# EAGLE design Rain Collector Outside v2 (EAGLE 6.5.0)
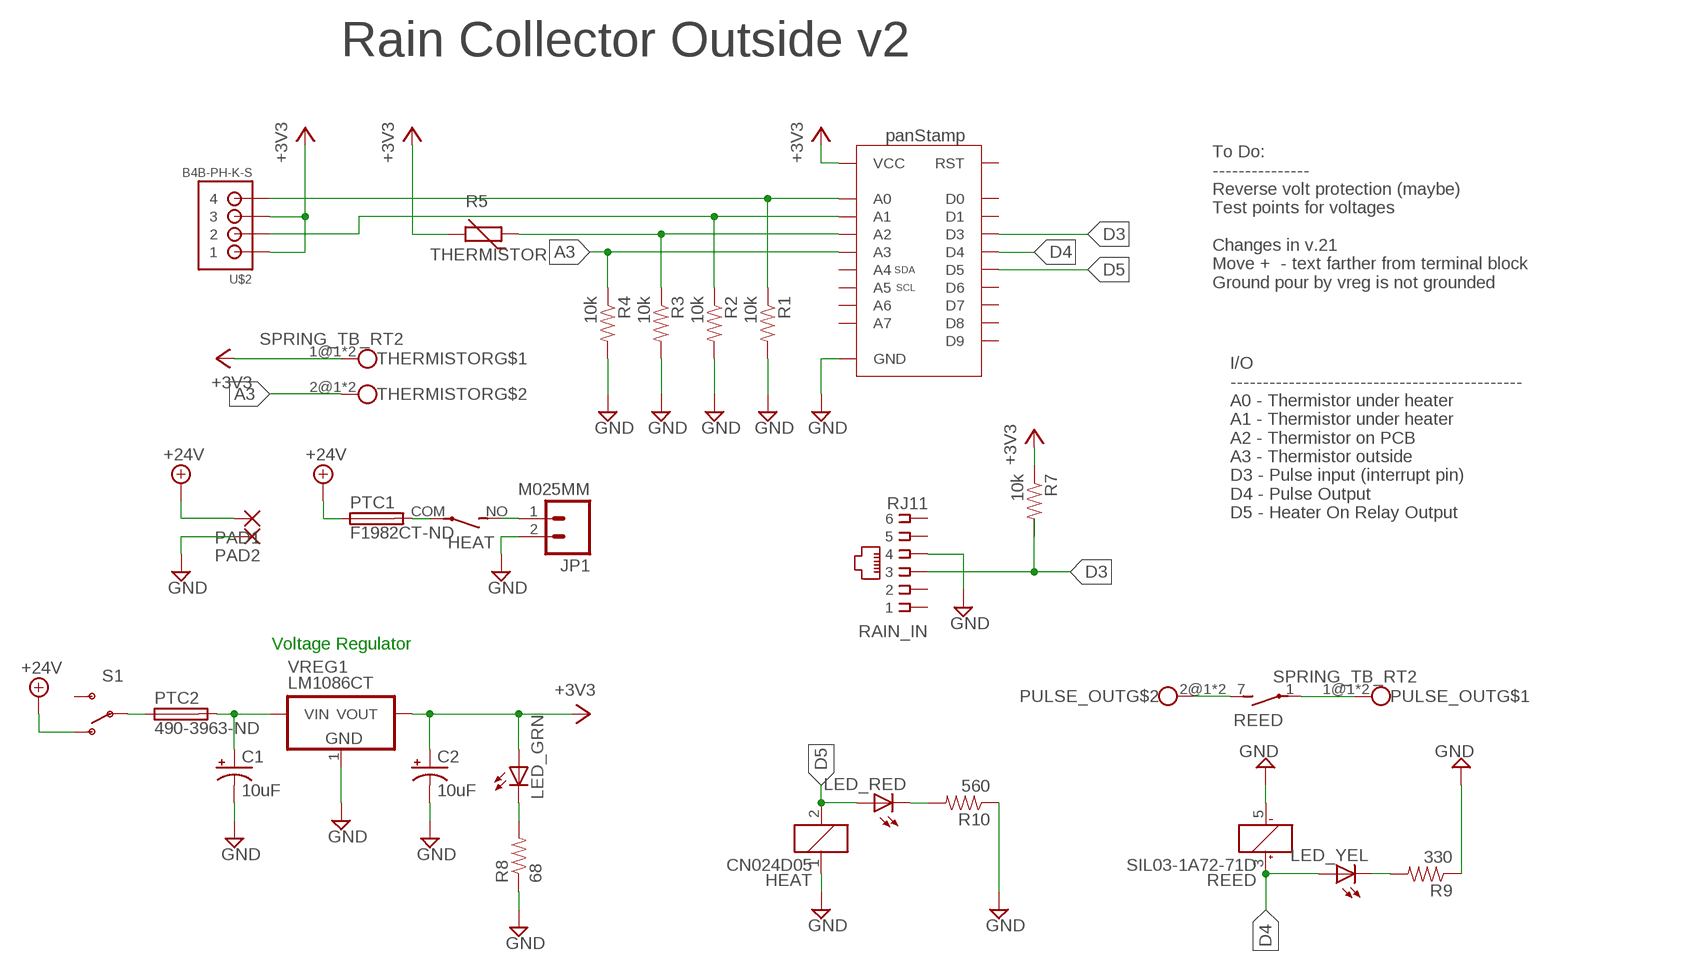
[diagram p0: schematic, sheet 1]

## Parts
C1  10uF  CAP_POLPTH2  [CPOL-RADIAL-10UF-25V]
C2  10uF  CAP_POLPTH2  [CPOL-RADIAL-10UF-25V]
HEAT  CN024D05  APF30212A  [APF30212A]
JP1  M025MM  [SCREWTERMINAL-5MM-2]
LED_GRN  LED3MM  [LED3MM]
LED_RED  LED3MM  [LED3MM]
LED_YEL  LED3MM  [LED3MM]
PAD1  3,17/1,3  [3,17/1,3]
PAD2  3,17/1,3  [3,17/1,3]
PANSTAMP  PANSTAMPNO_TEXT  [PANSTAMP_NOTEXT]
PTC1  F1982CT-ND  TE5  [TE5]
PTC2  490-3963-ND  TE5  [TE5]
PULSE_OUT  SPRING_TB_RT2  [SPRING_TB_RT2]
R1  10k  RESISTORAXIAL-0.3  [AXIAL-0.3]
R2  10k  RESISTORAXIAL-0.3  [AXIAL-0.3]
R3  10k  RESISTORAXIAL-0.3  [AXIAL-0.3]
R4  10k  RESISTORAXIAL-0.3  [AXIAL-0.3]
R5  THERMISTOR  THERMISTOR-2,5  [RS-2,5]
R7  10k  RESISTORAXIAL-0.3  [AXIAL-0.3]
R8  68  RESISTORAXIAL-0.3  [AXIAL-0.3]
R9  330  RESISTORAXIAL-0.3  [AXIAL-0.3]
R10  560  RESISTORAXIAL-0.3  [AXIAL-0.3]
RAIN_IN  RJ11  RJ11-2X  [RJ11-NO_SHIELD]
REED  SIL03-1A72-71D  REED  [REED]
S1  SWITCH-SPDTPTH  [SWITCH-SPDT]
THERMISTOR  SPRING_TB_RT2  [SPRING_TB_RT2]
U$2  B4B-PH-K-S  JST-PH_4-PIN_HEADER  [JST_B4B-PH_HEADER]
VREG1  LM1086CT  VREG_3PINS-TO-220V  [TO-220V]

## Nets
+3V3 [Power]: C2.1(+) LED_GRN.A PANSTAMP.VCC R5.2 R7.P$1 THERMISTOR.1@1 THERMISTOR.1@2 U$2.P1 U$2.P3 VREG1.2(VOUT)
+24V [Heater]: PAD1.1(P) PTC1.1 S1.1(O)
A0: PANSTAMP.A0 R1.P$1 U$2.P4
A1: PANSTAMP.A1 R2.P$1 U$2.P2
A2: PANSTAMP.A2 R3.P$1 R5.1
A3: PANSTAMP.A3 R4.P$1 THERMISTOR.2@1 THERMISTOR.2@2
D3: PANSTAMP.D3 R7.P$2 RAIN_IN.3
D4: LED_YEL.A PANSTAMP.D4 REED.3(1:+)
D5: HEAT.2 LED_RED.A PANSTAMP.D5
GND: C1.2(-) C2.2(-) HEAT.1 JP1.2 PAD2.1(P) PANSTAMP.GND$1(GND) PANSTAMP.GND$7(GND) PANSTAMP.GND$15(GND) PANSTAMP.GND$23(GND) PANSTAMP.GND$24(GND) R1.P$2 R2.P$2 R3.P$2 R4.P$2 R8.P$1 R9.P$1 R10.P$1 RAIN_IN.4 REED.5(1:-) VREG1.1(GND)
N$1: PULSE_OUT.2@1 PULSE_OUT.2@2 REED.7(2:S)
N$2: PULSE_OUT.1@1 PULSE_OUT.1@2 REED.1(2:P)
N$3 [Heater]: HEAT.NO(2:S) JP1.1
N$4: LED_GRN.K(C) R8.P$2
N$5: LED_YEL.K(C) R9.P$2
N$6: LED_RED.K(C) R10.P$2
N$7: PTC2.1 S1.2(P)
N$8 [Heater]: C1.1(+) PTC2.2 VREG1.3(VIN)
N$10: HEAT.COM(2:P) PTC1.2
Unconnected: PANSTAMP.A4 PANSTAMP.A5 PANSTAMP.A6 PANSTAMP.A7 PANSTAMP.D0 PANSTAMP.D1 PANSTAMP.D6 PANSTAMP.D7 PANSTAMP.D8 PANSTAMP.D9 PANSTAMP.RESET(RST) RAIN_IN.1 RAIN_IN.2 RAIN_IN.5 RAIN_IN.6 S1.3(S)

## Notes on the sheet
- Rain Collector Outside v2
- To Do:
  ---------------
  Reverse volt protection (maybe)
  Test points for voltages
  
  Changes in v.21
  Move +  - text farther from terminal block
  Ground pour by vreg is not grounded
- I/O
  ---------------------------------------------
  A0 - Thermistor under heater
  A1 - Thermistor under heater
  A2 - Thermistor on PCB
  A3 - Thermistor outside
  D3 - Pulse input (interrupt pin)
  D4 - Pulse Output
  D5 - Heater On Relay Output
- Voltage Regulator

## Library data of the parts
C1 C2 = SparkFun-Capacitors:CAP_POL: Capacitor Polarized These are standard SMD and PTH capacitors. Normally 10uF, 47uF, and 100uF in electrolytic and tantalum varieties. Always verify the external diameter of the through hole cap, it varies with capacity, voltage, and manufacturer. The EIA devices should be standard.; PARTNO: 478-6062-ND
HEAT = relay:APF30212A: Compliant with European standards 1a/1c 6A Slim power relays Source: Data sheet <http://pewa.panasonic.com/assets/pcsd/catalog/pf-catalog.pdf>; OC_FARNELL: unknown; PARTNO: CC1742-ND
JP1 = SparkFun-Connectors:M02: Standard 2-pin 0.1" header. Use with - straight break away headers ( PRT-00116) - right angle break away headers (PRT-00553) - swiss pins (PRT-00743) - machine pins (PRT-00117) - female headers (PRT-00115) Molex polarized connector foot print use with: PRT-08233 with associated crimp pins and housings. 2.54_SCREWTERM for use with PRT-10571. 3.5mm Screw Terminal footprints for PRT-08084 5mm Screw Terminal footprints for use with PRT-08433; PARTNO: Sparkfun PRT-08432
LED_GRN LED_RED LED_YEL = led:LED: LED OSRAM: - CHIPLED LG R971, LG N971, LY N971, LG Q971, LY Q971, LO R971, LY R971 LH N974, LH R974 LS Q976, LO Q976, LY Q976 LO Q996 - Hyper CHIPLED LW Q18S LB Q993, LB Q99A, LB R99A - SideLED LS A670, LO A670, LY A670, LG A670, LP A670 LB A673, LV A673, LT A673, LW A673 LH A674 LY A675 LS A676, LA A676, LO A676, LY A676, LW A676 LS A679, LY A679, LG A679 - Hyper Micro SIDELED® LS Y876, LA Y876, LO Y876, LY Y876 LT Y87S - SmartLED LW L88C, LW L88S LB L89C, LB L89S, LG L890 LS L89K, LO L89K, LY L89K LS L896, LA L896, LO L896, LY L896 - TOPLED LS T670, LO T670, LY T670, LG T670, LP T670 LSG T670, LSP T670, LSY T670, LOP T670, LYG T670 LG T671, LOG T671, LSG T671 LB T673, LV T673, LT T673, LW T673 LH T674 LS T676, LA T676, LO T676, LY T676, LB T676, LH T676, LSB T676, LW T676 LB T67C, LV T67C, LT T67C, LS T67K, LO T67K, LY T67K, LW E67C LS E67B, LA E67B, LO E67B, LY E67B, LB E67C, LV E67C, LT E67C LW T67C LS T679, LY T679, LG T679 LS T770, LO T770, LY T770, LG T770, LP T770 LB T773, LV T773, LT T773, LW T773 LH T774 LS E675, LA E675, LY E675, LS T675 LS T776, LA T776, LO T776, LY T776, LB T776 LHGB T686 LT T68C, LB T68C - Hyper Mini TOPLED® LB M676 - Mini TOPLED Santana® LG M470 LS M47K, LO M47K, LY M47K Source: http://www.osram.convergy.de LUXEON: - LUMILED® LXK2-PW12-R00, LXK2-PW12-S00, LXK2-PW14-U00, LXK2-PW14-V00 LXK2-PM12-R00, LXK2-PM12-S00, LXK2-PM14-U00 LXK2-PE12-Q00, LXK2-PE12-R00, LXK2-PE12-S00, LXK2-PE14-T00, LXK2-PE14-U00 LXK2-PB12-K00, LXK2-PB12-L00, LXK2-PB12-M00, LXK2-PB14-N00, LXK2-PB14-P00, LXK2-PB14-Q00 LXK2-PR12-L00, LXK2-PR12-M00, LXK2-PR14-Q00, LXK2-PR14-R00 LXK2-PD12-Q00, LXK2-PD12-R00, LXK2-PD12-S00 LXK2-PH12-R00, LXK2-PH12-S00 LXK2-PL12-P00, LXK2-PL12-Q00, LXK2-PL12-R00 Source: www.luxeon.com KINGBRIGHT: KA-3528ASYC Source: www.kingbright.com
PAD1 PAD2 = wirepad:3,17/1,3: THROUGH-HOLE PAD
PANSTAMP = SRG:PANSTAMP: panStamp panStamps are small wireless modules programmable from the Arduino IDE. Each module contains an Atmega328p MCU and a Texas Instruments CC1101 RF interface, providing the necessary connectivity and processing power to create autonomous low-power wireless motes. Everything contained into a compact DIP-24 module. http://www.panstamp.com Vin: 2.5 to 3.6 volts A4 - SDA A5 - SCL PWM: D3,5,6,9,10,11 Interrupts: D2,3 Connected grounds with command: CONNECT ANY GND 'GND$1 GND$7 GND$15 GND$23 GND$24';
PTC1 = fuse:TE5: FUSE Wickmann; OC_FARNELL: unknown; OC_NEWARK: unknown; PARTNO: F1982CT-ND
PTC2 = fuse:TE5: FUSE Wickmann; OC_FARNELL: unknown; OC_NEWARK: unknown; PARTNO: 490-3963-ND
PULSE_OUT = SRG:SPRING_TB_RT2: Spring Loaded Terminal Block 4UCON 0.10 pitch right angle 2 amps 20-26 AWG Adafruit: P/N 1074 <http://www.adafruit.com/products/1074> Terminal block comes with 3 terminals, but the are modular so you can add or remove terminals; PARTNO: Sprakfun PRT-08073
R1-R4 R7 = SparkFun-Resistors:RESISTOR: Resistor Basic schematic elements and footprints for 0603, 1206, and PTH resistors.; PARTNO: RNF18FTD10K0CT-ND
R5 = varistor:THERMISTOR: THERMISTOR; PARTNO: BC2301-ND
R8 = SparkFun-Resistors:RESISTOR: Resistor Basic schematic elements and footprints for 0603, 1206, and PTH resistors.; PARTNO: CF18JT68R0CT-ND
R9 = SparkFun-Resistors:RESISTOR: Resistor Basic schematic elements and footprints for 0603, 1206, and PTH resistors.; PARTNO: CF18JT330RCT-ND
R10 = SparkFun-Resistors:RESISTOR: Resistor Basic schematic elements and footprints for 0603, 1206, and PTH resistors.; PARTNO: CF18JT560RCT-ND
RAIN_IN = con-tycoelectronics:RJ11: CORCOM Modular RJ Jacks No Shield Source: www.tycoelectronics.com .. ENG_DS_1654001_1099_RJ_L_0507.pdf; OC_FARNELL: unknown; OC_NEWARK: unknown; PARTNO: A31406-ND
REED = relay:REED: RELAY reed, 1 x norm. open with polarity, grid 5.08; OC_FARNELL: unknown; OC_NEWARK: unknown; PARTNO: 374-1322-ND
S1 = SparkFun-Electromechanical:SWITCH-SPDT: SPDT Switch Simple slide switch, Spark Fun Electronics SKU : COM-00102 DPDT SMT slide switch, AYZ0202, SWCH-08179; PARTNO: EG1903-ND
THERMISTOR = SRG:SPRING_TB_RT2: Spring Loaded Terminal Block 4UCON 0.10 pitch right angle 2 amps 20-26 AWG Adafruit: P/N 1074 <http://www.adafruit.com/products/1074> Terminal block comes with 3 terminals, but the are modular so you can add or remove terminals; PARTNO: Sparkfun PRT-08073
U$2 = SRG:JST-PH_4-PIN_HEADER: 4-pin JST PH Shrouded Header, top entry P/N B4B-PH-K-S Mating connector PHR-4 Mating cable assembly: Sparkfun PRT-09916 <http://www.sparkfun.com/products/9916>; PARTNO: 455-1706-ND
VREG1 = dp_devices:VREG_3PINS: Various 3 pin voltage regulators in different packages Double check the right pinout for the right part

## Net classes
0 default: width 0.508 mm, drill 0.254 mm, clearance 0.381 mm
1 Heater: width 1.143 mm, drill 0.508 mm, clearance 0.381 mm
2 Power: width 0.508 mm, drill 0.508 mm, clearance 0.279 mm

## Board
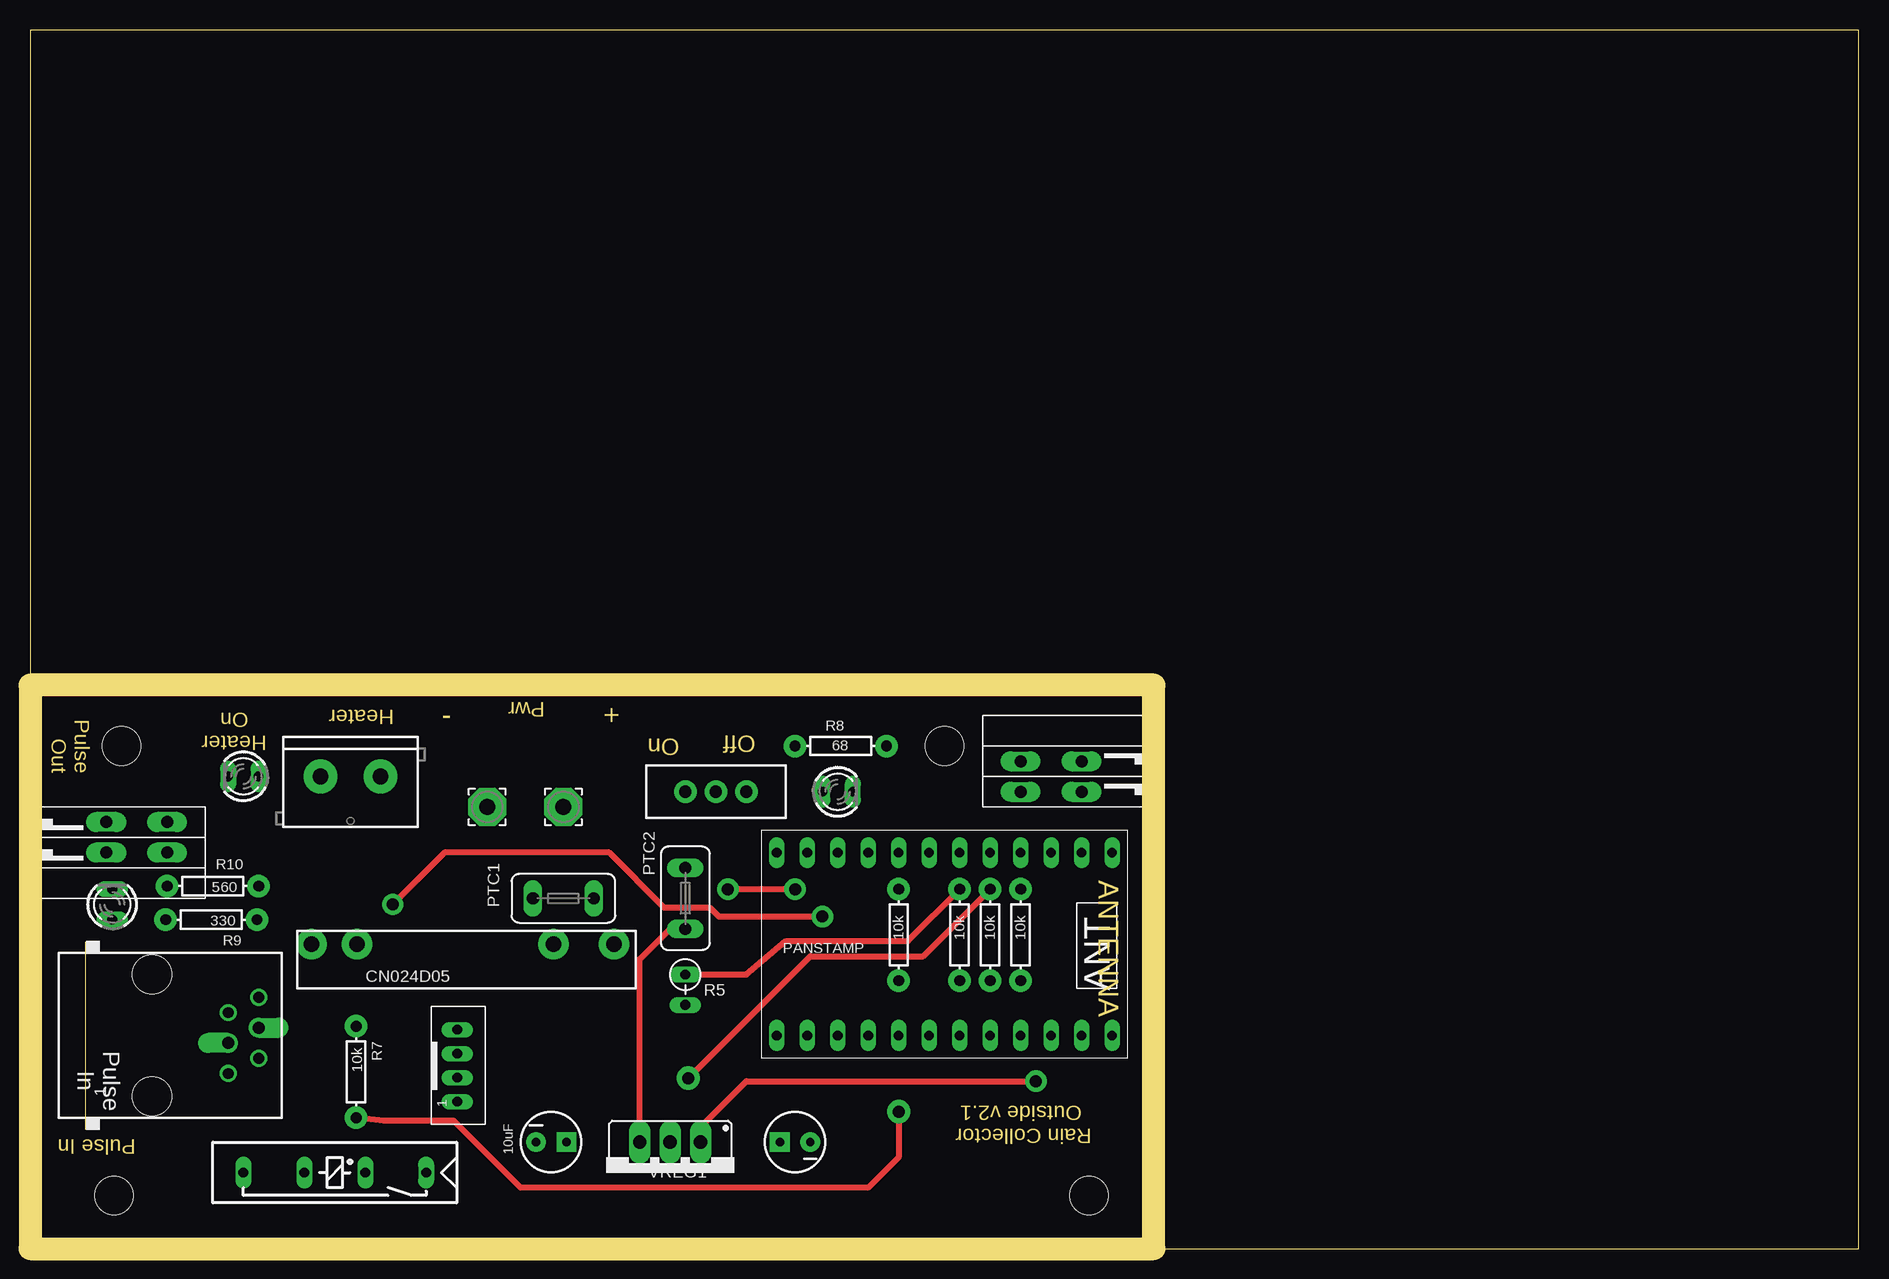
[diagram p1: board, top side]
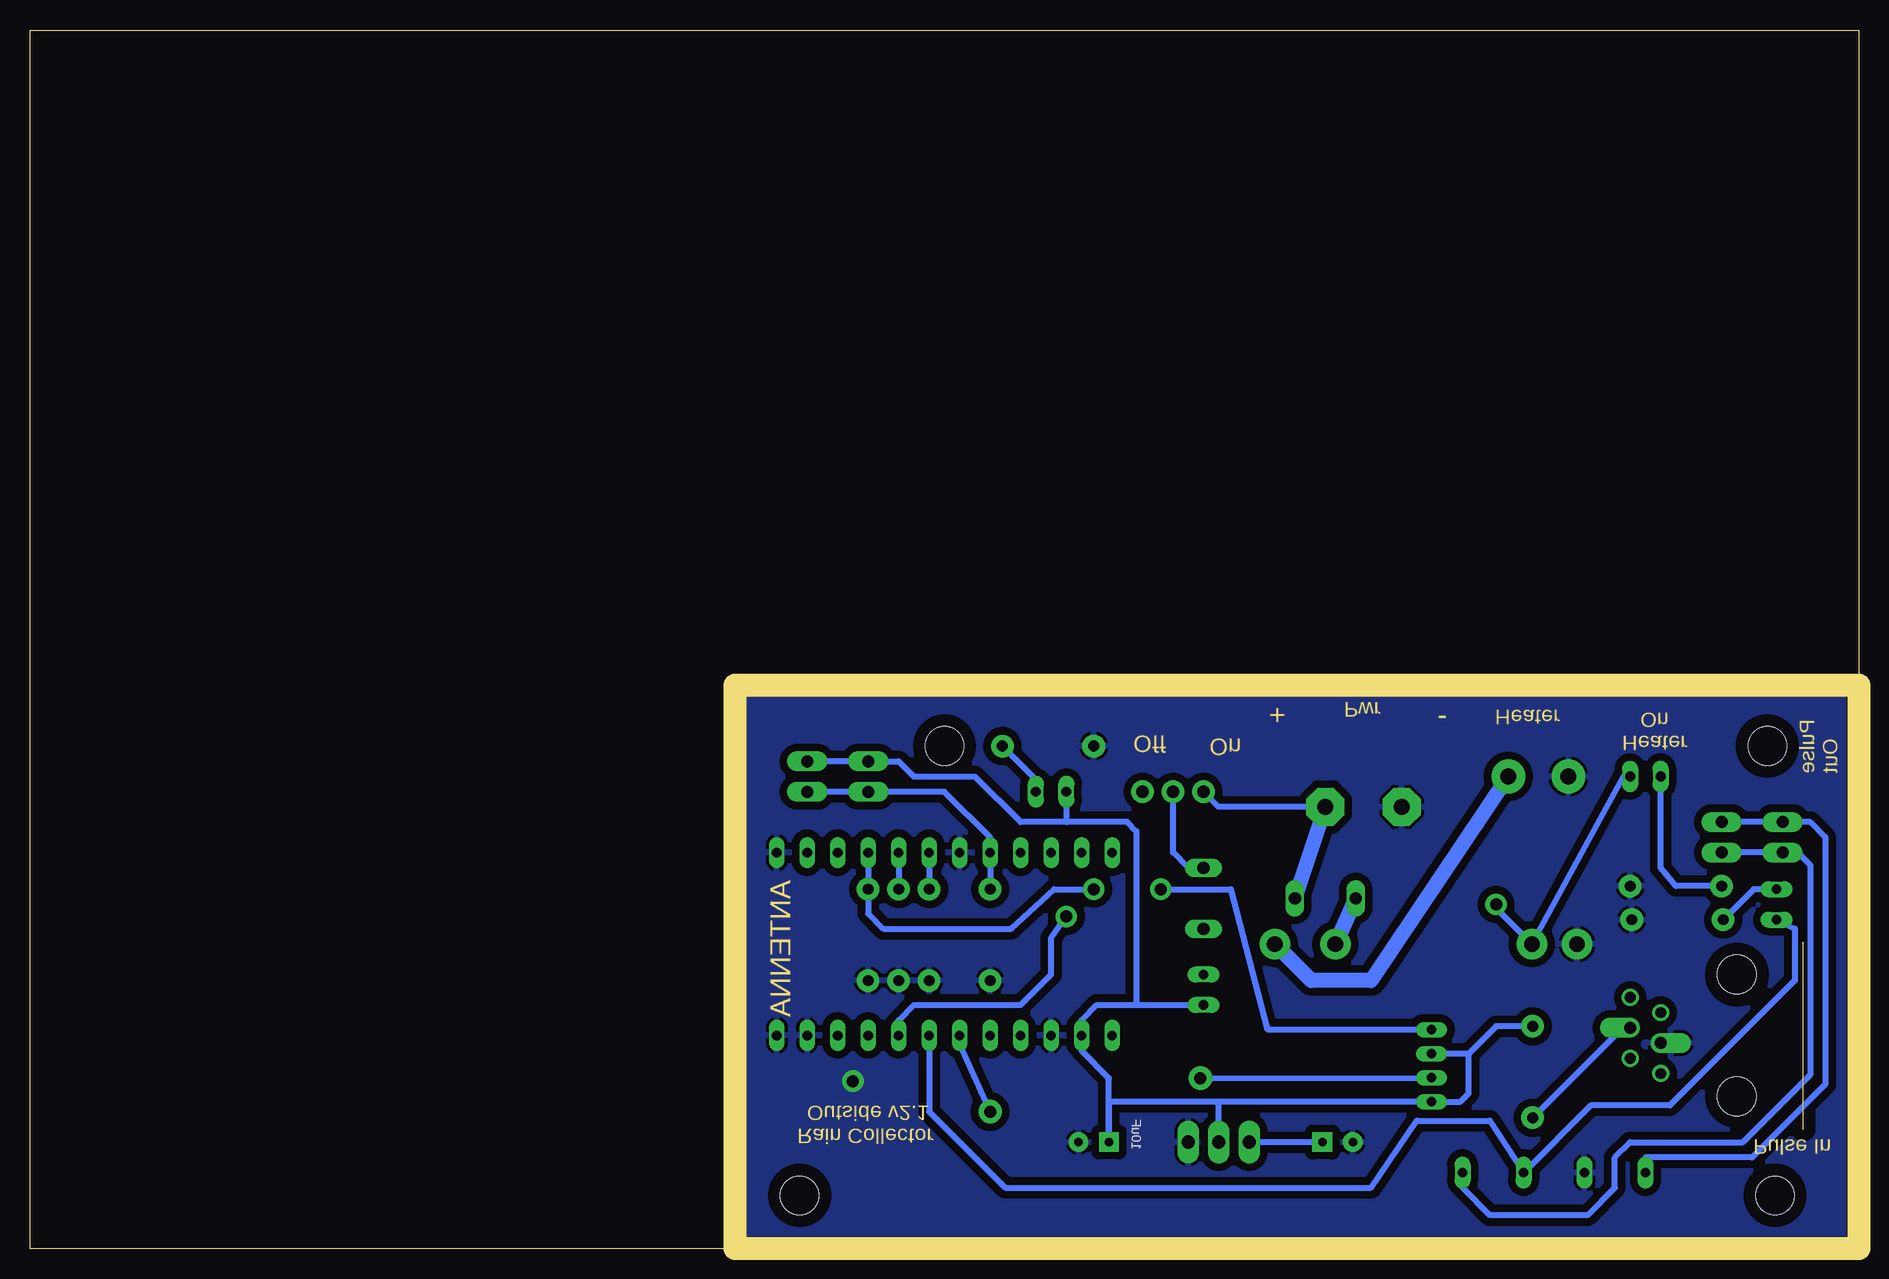
[diagram p2: board, bottom side, seen from below]

Size 152.4 x 101.6 mm. Coordinates in mm from the lower left corner, seen from the top.
Outline: 0,0 152.4,0 152.4,101.6 0,101.6 0,0
Copper layers (1*16): Top 0.035mm / dielectric 1.5mm / Bottom 0.035mm
Design rules "ShapeOko": minimum track width 12mil, minimum drill 24mil, track to track 25mil, track to pad 25mil, pad to pad 25mil, via to via 25mil, smd to smd 25mil, copper to edge 40mil, drill to drill 8mil, minimum pad ring 10mil, minimum via ring 8mil, stop-mask expansion 4mil, vias tented up to drill 0mil, thermal gap 10mil
Holes 3.2 mm at 88.27,4.45 76.2,41.91 7.62,41.91 6.99,4.45
Holes 0.6 mm at 0,0 93.98,0 0,46.99 93.98,46.99
Milling: 4 lines

### Footprints (pad centres in the part's own frame; a part is rotated, then mirrored left to right if it is on the bottom)
CPOL-RADIAL-10UF-25V = drill 0.7 pad 1.651 square: 1 1.27,0 | drill 0.7 pad 1.651: 2 -1.27,0
APF30212A = drill 1.3 pad 2.54: 1 -12.6,0; 2 -8.82,0; COM 7.56,0; NO 12.6,0
SCREWTERMINAL-5MM-2 = drill 1.3 pad 2.794: 1 0,0; 2 5,0
LED3MM = drill 0.813 long: A -1.27,0; K 1.27,0
3,17/1,3 = drill 1.321 pad 3.175 octagon: 1 0,0
PANSTAMP_NOTEXT = drill 0.8 long: A0 -7.62,6.35; A1 -7.62,3.81; A2 -7.62,1.27; A3 -7.62,-3.81; A4 -7.62,-6.35; A5 -7.62,-8.89; A6 -7.62,-11.43; A7 -7.62,-13.97; D0 7.62,-6.35; D1 7.62,-3.81; D3 7.62,-1.27; D4 7.62,1.27; D5 7.62,3.81; D6 7.62,6.35; D7 7.62,8.89; D8 -7.62,11.43; D9 -7.62,8.89; GND$1 -7.62,13.97; GND$7 -7.62,-1.27; GND$15 7.62,-8.89; GND$23 7.62,11.43; GND$24 7.62,13.97; RESET 7.62,-13.97; VCC 7.62,-11.43
TE5 = drill 1.016 long: 1 -2.54,0; 2 2.54,0
SPRING_TB_RT2 = drill 1 pad 1.676 long: 1@1 -1.27,2.54; 1@2 -1.27,-2.54; 2@1 1.27,2.54; 2@2 1.27,-2.54
AXIAL-0.3 = drill 0.9 pad 1.88: P$1 -3.81,0; P$2 3.81,0
RS-2,5 = drill 0.813 long: 1 -1.27,0; 2 1.27,0
RJ11-NO_SHIELD = drill 0.9 pad 1.4: 1 -3.175,8.89; 2 -1.905,6.35; 5 1.905,8.89; 6 3.175,6.35 | drill 1 pad 1.676 offset: 3 -0.635,8.89; 4 0.635,6.35 | hole 3.251: -5.08,0; 5.08,0
REED = drill 0.813 long: 1 -17.78,2.54; 3 -12.7,2.54; 5 -7.62,2.54; 7 -2.54,2.54
SWITCH-SPDT = drill 1.016 pad 1.88: 1 0,2.54; 2 0,0; 3 0,-2.54
JST_B4B-PH_HEADER = drill 0.8 long: P1 2.98,0.048; P2 0.98,0.048; P3 -1.02,0.048; P4 -3.02,0.048
TO-220V = drill 1.1 pad 1.778 long: 1 -2.54,0; 2 0,0; 3 2.54,0

### Placement (x,y rotation side)
C1  43.43,8.89 0 top
C2  63.75,8.89 180 top
HEAT  36.07,25.4 0 top
JP1  29.21,39.37 180 top
LED_GRN  67.31,38.1 0 top
LED_RED  17.78,39.37 180 top
LED_YEL  6.86,28.7 90 top
PAD1  44.45,36.83 0 top
PAD2  38.1,36.83 0 top
PANSTAMP  76.2,25.4 270 top
PTC1  44.45,29.21 180 top
PTC2  54.61,29.21 270 top
PULSE_OUT  8.89,34.29 90 top
R1  82.55,26.16 270 top
R2  80.01,26.16 270 top
R3  77.47,26.16 270 top
R4  72.39,26.16 270 top
R5  54.61,21.59 270 top
R7  27.18,14.73 270 top
R8  67.56,41.91 0 top
R9  15.11,27.43 180 top
R10  15.24,30.23 180 top
RAIN_IN  10.16,17.78 270 top
REED  15.24,8.89 180 top
S1  57.15,38.1 90 top
THERMISTOR  85.09,39.37 270 top
U$2  35.56,15.24 270 top
VREG1  53.34,8.89 180 top

### Tracks (layer width: path | path; a pad name or v marks a point on that pad's centre or on a via)
+3V3
  Bottom 0.508: 60.2,20.32 63.5,20.32 64.77,19.05 PANSTAMP.VCC 64.77,16.51 62.48,14.22 C2.1 62.48,12.26 53.34,12.26 | 60.2,20.32 R5.2 | 60.2,20.32 60.2,34.8 60.96,35.56 66.04,35.56 | R7.P$1 30.23,18.54 32.51,16.26 | 32.51,16.26 U$2.P3 | 32.51,16.26 32.51,12.95 33.21,12.26 U$2.P1 53.34,12.26 | THERMISTOR.1@1 THERMISTOR.1@2 80.01,40.64 78.74,39.37 73.66,39.37 69.85,35.56 66.04,35.56 | LED_GRN.A 66.04,35.56 | VREG1.2 53.34,12.26
+24V
  Bottom 0.508: PAD1.1 53.34,36.83 S1.1
  Bottom 1.27: PAD1.1 PTC1.1
A0  (via drill 1 pad 1.78)
  Top 0.508: v63.75,29.97 v58.17,29.97
  Bottom 0.508: PANSTAMP.A0 R1.P$1 82.55,27.94 81.28,26.67 70.61,26.67 67.06,29.97 v63.75,29.97 | U$2.P4 35.64,18.29 49.28,18.29 52.32,29.97 v58.17,29.97
A1  (via drill 1 pad 1.93)
  Top 0.508: v54.86,14.22 65.02,24.38 74.42,24.38 R2.P$1
  Bottom 0.508: PANSTAMP.A1 R2.P$1 | v54.86,14.22 U$2.P2
A2
  Top 0.508: R5.1 59.69,22.86 62.99,25.65 73.15,25.65 R3.P$1
  Bottom 0.508: PANSTAMP.A2 R3.P$1
A3
  Bottom 0.508: R4.P$1 PANSTAMP.A3 72.39,34.29 76.2,38.1 THERMISTOR.2@2 THERMISTOR.2@1
D3  (via drill 1 pad 1.93)
  Top 0.508: v72.39,11.43 72.39,7.62 69.85,5.08 40.89,5.08 35.31,10.67 29.46,10.67 R7.P$2
  Bottom 0.508: PANSTAMP.D3 74.93,17.02 v72.39,11.43 | RAIN_IN.3 19.68,18.41 R7.P$2
D4
  Bottom 0.508: PANSTAMP.D4 77.47,11.43 71.12,5.08 40.64,5.08 36.83,10.67 30.73,10.67 REED.3 22.35,11.94 15.75,11.94 5.33,22.35 5.33,26.67 LED_YEL.A
D5  (via drill 1 pad 1.78)
  Top 0.508: v66.04,27.69 57.4,27.69 56.64,28.45 52.83,28.45 48.26,33.02 34.54,33.02 v30.23,28.7
  Bottom 0.508: PANSTAMP.D5 80.01,19.05 78.74,20.32 69.85,20.32 67.31,22.86 67.31,25.91 v66.04,27.69 | LED_RED.A 19.63,39.37 HEAT.2 30.23,28.38 v30.23,28.7
GND  (via drill 1 pad 1.78)
  Top 0.508: VREG1.1 55.88,10.16 59.69,13.97 v83.82,13.97
  pour Bottom: 0,46.99 93.98,46.99 93.98,0 0,0
N$1
  Bottom 0.508: PULSE_OUT.2@2 PULSE_OUT.2@1 4.06,35.56 2.79,34.29 2.79,13.72 8.89,7.62 17.78,7.62 REED.7
N$2
  Bottom 0.508: PULSE_OUT.1@2 PULSE_OUT.1@1 5.08,33.02 4.06,32 4.06,14.48 9.65,8.89 19.05,8.89 20.32,7.62 20.32,5.08 22.61,2.79 30.73,2.79 33.02,5.08 REED.1
N$3
  Bottom 1.27: JP1.1 40.64,22.35 45.62,22.35 HEAT.NO
N$4
  Bottom 0.508: LED_GRN.K 68.58,39.12 R8.P$2
N$5
  Bottom 0.508: LED_YEL.K 8.76,29.97 R9.P$2
N$6
  Bottom 0.508: R10.P$2 15.24,30.23 16.51,31.75 LED_RED.K
N$7
  Bottom 0.508: PTC2.1 55.88,31.75 57.15,33.02 S1.2
N$8
  Top 0.508: PTC2.2 53.34,26.67 50.8,24.13 VREG1.3
  Bottom 0.508: C1.1 VREG1.3
N$10
  Bottom 1.27: PTC1.2 HEAT.COM

### Text on the board
tPlace: CN024D05 | Pulse / In | 1
Milling: Pwr | Heater / On | Heater | - | + | On | Off | Pulse / Out | ANTENNA | Rain Collector / Outside v2.1 | Pulse In